# EAGLE design GPS_radiologger_v7 (EAGLE 9.5.2)
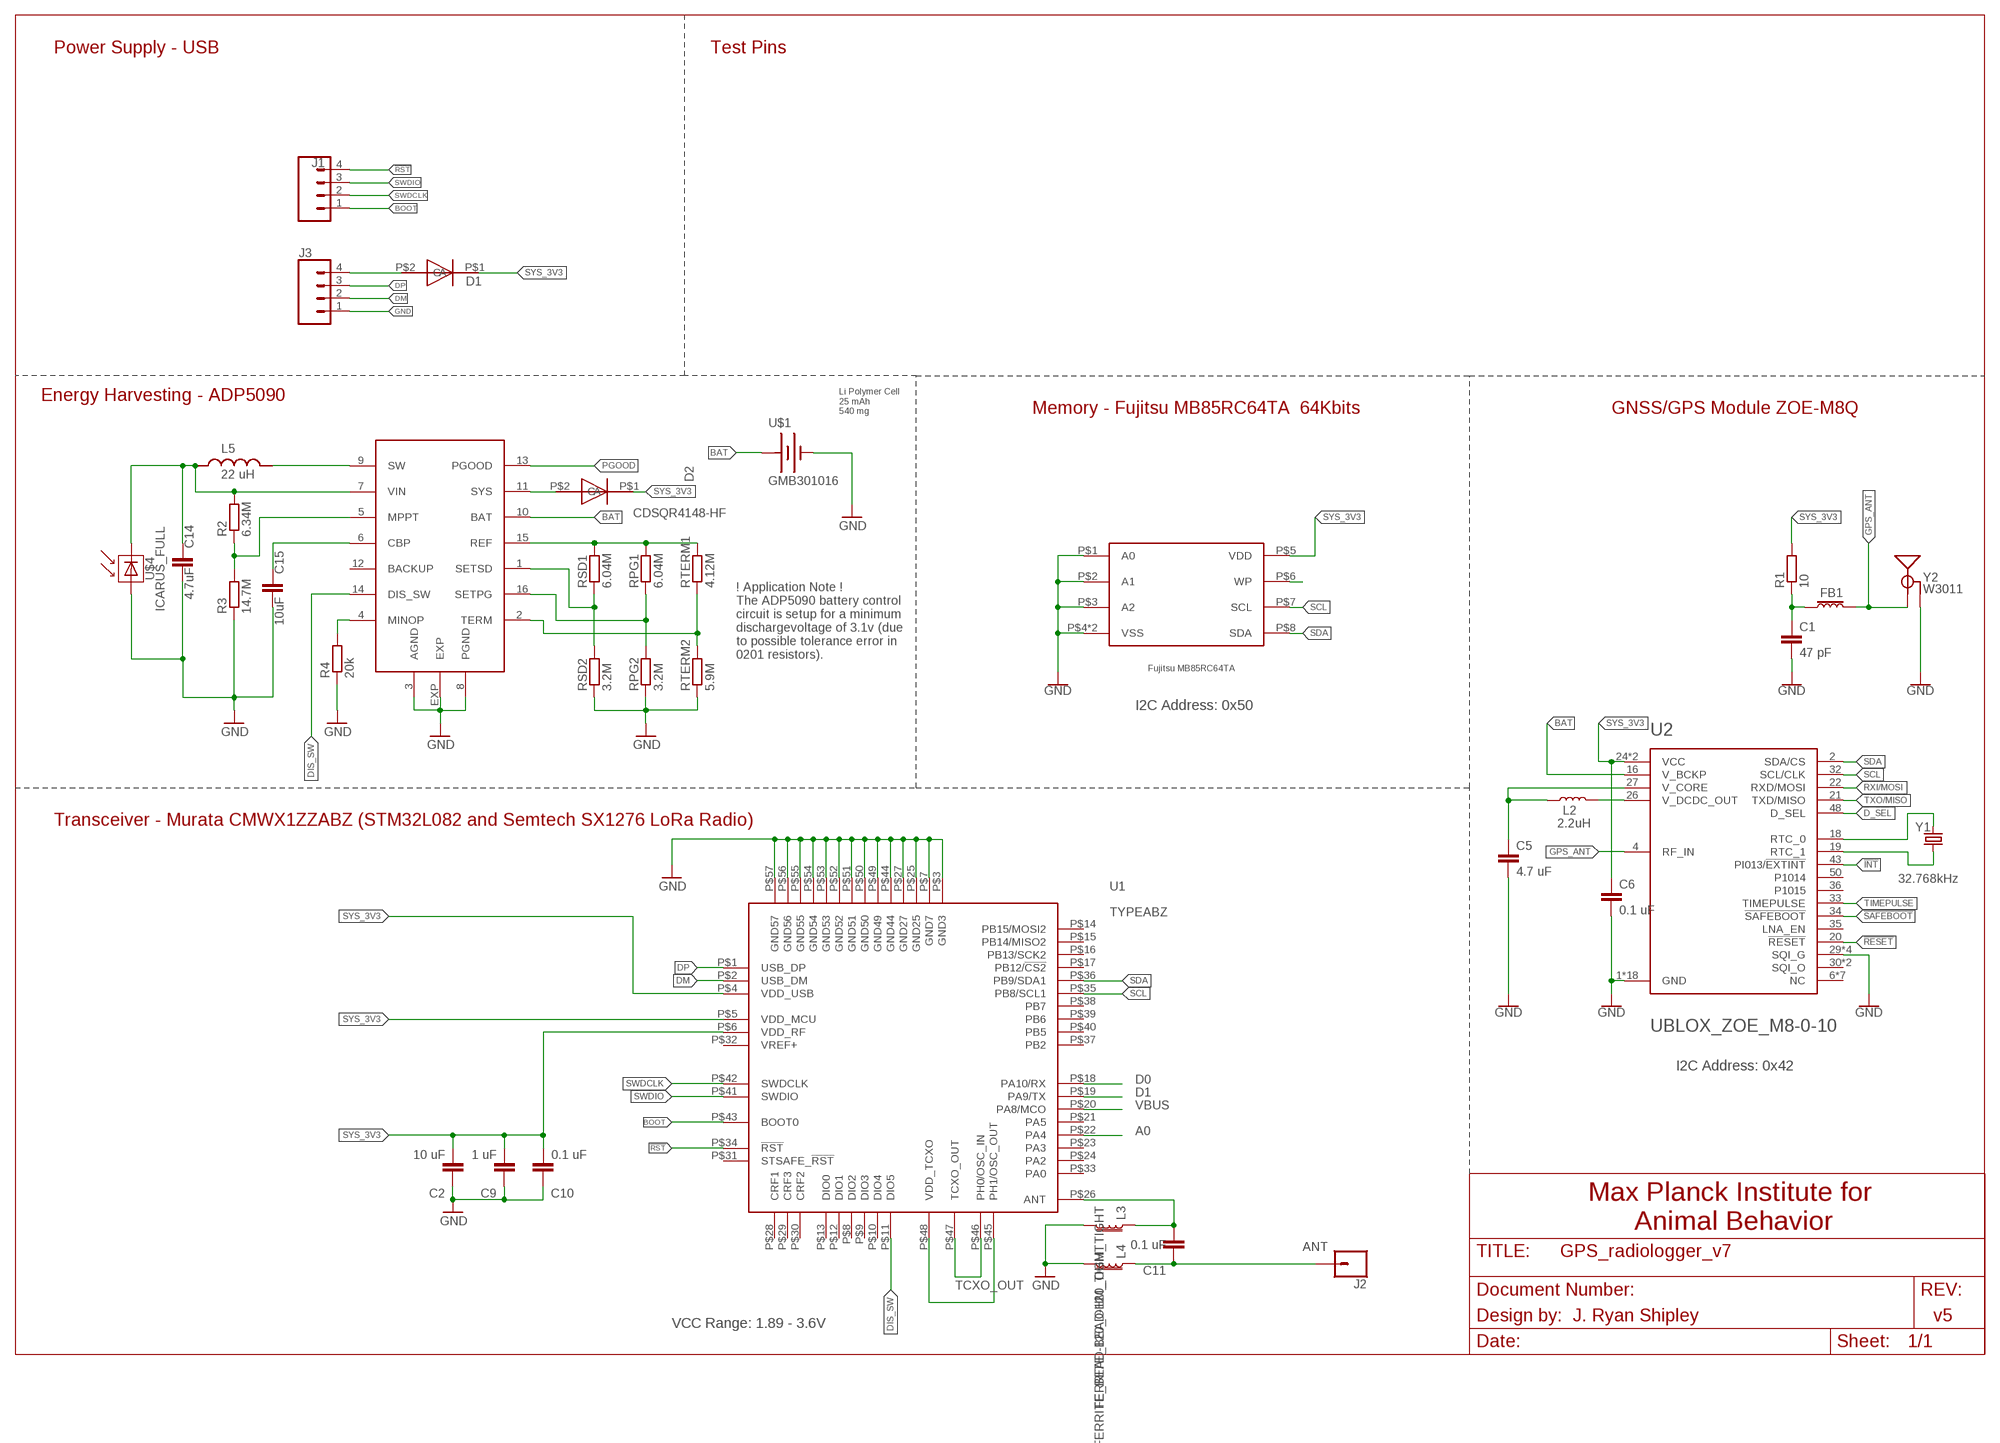
[diagram p0: schematic, sheet 1]

## Parts
C1  47 pF  C-EUC0201  [C0201]
C2  10 uF  C-EUC0201  [C0201]
C5  4.7 uF  C-EUC0201  [C0201]
C6  0.1 uF  C-EUC0201  [C0201]
C9  1 uF  C-EUC0201  [C0201]
C10  0.1 uF  C-EUC0201  [C0201]
C11  0.1 uF  C-EUC0201  [C0201]
C14  4.7uF  C-EUC0201  [C0201]
C15  10uF  C-EUC0402  [C0402]
D1  CDSQR4148-HF  [CDSQR4148-HF]
D2  CDSQR4148-HF  [CDSQR4148-HF]
FB1  FERRITE_BEAD-120_OHM_TIGHT  [0402-TIGHT]
J1  CONN_041.27MM_NO_SILK  [1X04_1.27MM_NO_SILK]
J2  CONN_01PTH_NO_SILK_SMALL  [1X01_SMALL]
J3  CONN_041.27MM_NO_SILK  [1X04_1.27MM_NO_SILK]
L2  2.2uH  2.2μH_SHIELDED_INDUCTOR  [0806]
L3  FERRITE_BEAD-120_OHM_TIGHT  [0402-TIGHT]
L4  FERRITE_BEAD-120_OHM_TIGHT  [0402-TIGHT]
L5  22 uH  LPS4012-103MRB  [IND_LPS4012-103MRB]
R1  10  R-EU_R0201  [R0201]
R2  6.34M  R-EU_R0201  [R0201]
R3  14.7M  R-EU_R0201  [R0201]
R4  20k  R-EU_R0201  [R0201]
RPG1  6.04M  R-EU_R0201  [R0201]
RPG2  3.2M  R-EU_R0201  [R0201]
RSD1  6.04M  R-EU_R0201  [R0201]
RSD2  3.2M  R-EU_R0201  [R0201]
RTERM1  4.12M  R-EU_R0201  [R0201]
RTERM2  5.9M  R-EU_R0201  [R0201]
U1  TYPEABZ  [TYPEABZ]
U2  UBLOX_ZOE_M8-0-10  [UBLOX_ZOE_M8-0-10]
U$1  GMB301016  [GMB301016]
U$2  MB85RC64TA  [8-SON_2X3]
U$3  ADP5090  [LFCSP-16-3X3]
U$4  ICARUS_FULL  [ICARUS_FULL]
Y1  32.768kHz  CRYSTAL-32.768KHZSMD-3.2X1.5  [CRYSTAL-SMD-3.2X1.5MM]
Y2  W3011  GPS_CHIP_ANTENNAW3011  [W3011]

## Nets
!INT: U2.43(PI013/!EXTINT)
!RESET: U2.20(!RESET)
!RST: J1.4 U1.P$34(!RST)
!SAFEBOOT: U2.34(!SAFEBOOT)
A0: U1.P$22(PA4)
ANT: C11.1 J2.P$1 L4.1
BAT: U2.16(V_BCKP) U$1.+ U$3.10(BAT)
BOOT: J1.1 U1.P$43(BOOT0)
D0: U1.P$18(PA10/RX)
D1: U1.P$19(PA9/TX)
D_SEL: U2.48(D_SEL)
DIS_SW: U1.P$11(DIO5) U$3.14(DIS_SW)
DM: J3.2 U1.P$2(USB_DM)
DP: J3.3 U1.P$1(USB_DP)
GND: C1.2 C2.1 C5.2 C6.2 C9.1 C10.1 C14.2 C15.2 J3.1 L3.2 L4.2 R3.1 R4.1 RPG2.1 RSD2.1 RTERM2.1 U1.P$3(GND3) U1.P$7(GND7) U1.P$25(GND25) U1.P$27(GND27) U1.P$44(GND44) U1.P$49(GND49) U1.P$50(GND50) U1.P$51(GND51) U1.P$52(GND52) U1.P$53(GND53) U1.P$54(GND54) U1.P$55(GND55) U1.P$56(GND56) U1.P$57(GND57) U2.1(GND) U2.3(GND) U2.5(GND) U2.7(GND) U2.8(GND) U2.9(GND) U2.10(GND) U2.11(GND) U2.12(GND) U2.17(GND) U2.23(GND) U2.29(SQI_G) U2.31(SQI_G) U2.37(GND) U2.38(GND) U2.39(GND) U2.40(GND) U2.41(GND) U2.44(GND) U2.46(SQI_G) U2.47(SQI_G) U2.49(GND) U$1.- U$2.P$1(A0) U$2.P$2(A1) U$2.P$3(A2) U$2.P$4(VSS) U$2.P$9(VSS) U$4.P$2(MINUS) Y2.2(GND) Y2.3(GND)
GPS_ANT: FB1.1 U2.4(RF_IN) Y2.1(SIGNAL)
N$1: U1.P$45(PH1/OSC_OUT) U1.P$48(VDD_TCXO)
N$2: D2.P$2(A) U$3.11(SYS)
N$3: U$2.P$6(WP)
N$4: L2.2 U2.26(V_DCDC_OUT)
N$5: L5.2 U$3.9(SW)
N$6: U$3.3(AGND) U$3.8(PGND) U$3.EXP ; supply symbol labelled GND
N$7: R2.1 R3.2 U$3.5(MPPT)
N$8: C15.1 U$3.6(CBP)
N$9: C1.1 FB1.2 R1.1
N$10: R4.2 U$3.4(MINOP)
N$11: RTERM1.1 RTERM2.2 U$3.2(TERM)
N$12: RPG1.1 RPG2.2 U$3.16(SETPG)
N$13: C5.1 L2.1 U2.27(V_CORE)
N$14: U2.18(RTC_0) Y1.P$2
N$15: U2.19(RTC_1) Y1.P$1
N$16: RSD1.1 RSD2.2 U$3.1(SETSD)
N$17: RPG1.2 RSD1.2 RTERM1.2 U$3.15(REF)
N$18: D1.P$2(A) J3.4
N$32: C11.2 L3.1 U1.P$26(ANT)
PGOOD: U$3.13(PGOOD)
RXI/MOSI: U2.22(RXD/MOSI)
SCL: U1.P$35(PB8/SCL1) U2.32(SCL/CLK) U$2.P$7(SCL)
SDA: U1.P$36(PB9/SDA1) U2.2(SDA/CS) U$2.P$8(SDA)
SWDCLK: J1.2 U1.P$42(SWDCLK)
SWDIO: J1.3 U1.P$41(SWDIO)
SYS_3V3: C2.2 C6.1 C9.2 C10.2 D1.P$1(C) D2.P$1(C) R1.2 U1.P$4(VDD_USB) U1.P$5(VDD_MCU) U1.P$6(VDD_RF) U2.24(VCC) U2.25(VCC) U$2.P$5(VDD)
TCXO_OUT: U1.P$46(PH0/OSC_IN) U1.P$47(TCXO_OUT)
TIMEPULSE: U2.33(TIMEPULSE)
TXO/MISO: U2.21(TXD/MISO)
VBUS: U1.P$20(PA8/MCO)
VIN: C14.1 L5.1 R2.2 U$3.7(VIN) U$4.P$1(PLUS)
Unconnected: U1.P$8(DIO2) U1.P$9(DIO3) U1.P$10(DIO4) U1.P$12(DIO1) U1.P$13(DIO0) U1.P$14(PB15/MOSI2) U1.P$15(PB14/MISO2) U1.P$16(PB13/SCK2) U1.P$17(PB12/!CS2) U1.P$21(PA5) U1.P$23(PA3) U1.P$24(PA2) U1.P$28(CRF1) U1.P$29(CRF3) U1.P$30(CRF2) U1.P$31(STSAFE_!RST) U1.P$33(PA0) U1.P$37(PB2) U1.P$38(PB7) U1.P$39(PB6) U1.P$40(PB5) U2.6(NC) U2.13(NC) U2.14(NC) U2.15(NC) U2.28(NC) U2.30(SQI_O) U2.35(LNA_EN) U2.36(P1015) U2.42(NC) U2.45(SQI_O) U2.50(P1014) U2.51(NC) U$3.12(BACKUP)

## Notes on the sheet
- Power Supply - USB | Test Pins
- Energy Harvesting - ADP5090
- Li Polymer Cell
  25 mAh
  540 mg
- Memory - Fujitsu MB85RC64TA  64Kbits | GNSS/GPS Module ZOE-M8Q
- ! Application Note !
  The ADP5090 battery control
  circuit is setup for a minimum
  dischargevoltage of 3.1v (due 
  to possible tolerance error in 
  0201 resistors).
- I2C Address: 0x50
- Transceiver - Murata CMWX1ZZABZ (STM32L082 and Semtech SX1276 LoRa Radio)
- I2C Address: 0x42
- Max Planck Institute for 
  Animal Behavior
- Design by: | J. Ryan Shipley | v5
- VCC Range: 1.89 - 3.6V

## Power pins joined to a net without a drawn wire
VREF+: U1.P$32(VREF+)

## Library data of the parts
C1 C2 C5 C6 C9-C11 C14 = rcl:C-EU: CAPACITOR, European symbol; SPICEPREFIX: C
C15 = resistor:C-EU: CAPACITOR, European symbol
D1 D2 = Kris:CDSQR4148-HF: ComChip's CDSQR4148-HF high speed 150 mA Io diode
FB1 L3 L4 = SparkFun-Coils:FERRITE_BEAD-120_OHM_TIGHT
J1 J3 = SparkFun-Connectors:CONN_04: Multi connection point. Often used as Generic Header-pin footprint for 0.1 inch spaced/style header connections On any of the 0.1 inch spaced packages, you can populate with these: Break Away Headers - Straight <https://www.sparkfun.com/products/116> (PRT-00116) Break Away Male Headers - Right Angle <https://www.sparkfun.com/products/553> (PRT-00553) Female Headers <https://www.sparkfun.com/products/115> (PRT-00115) Break Away Headers - Machine Pin <https://www.sparkfun.com/products/117> (PRT-00117) Break Away Female Headers - Swiss Machine Pin <https://www.sparkfun.com/products/743> (PRT-00743) For SCREWTERMINALS and SPRING TERMINALS visit here: Screw Terimnals on SparkFun.com <https://www.sparkfun.com/search/results?term=Screw+Terminals> (5mm/3.5mm/2.54mm spacing) This device is also useful as a general connection point to wire up your design to another part of your project. Our various solder wires solder well into these plated through hole pads. Hook-Up Wire - Assortment (Stranded, 22 AWG) <https://www.sparkfun.com/products/11375> (PRT-11375) Hook-Up Wire - Assortment (Solid Core, 22 AWG) <https://www.sparkfun.com/products/11367> (PRT-11367) View the entire wire category on our website here <https://www.sparkfun.com/categories/141> Special notes: Molex polarized connector foot print use with SKU : PRT-08231 with associated crimp pins and housings. 1MM SMD Version SKU: PRT-10208
J2 = SparkFun-Connectors:CONN_01: Single connection point. Often used as Generic Header-pin footprint for 0.1 inch spaced/style header connections On any of the 0.1 inch spaced packages, you can populate with these: Break Away Headers - Straight <https://www.sparkfun.com/products/116> (PRT-00116) Break Away Male Headers - Right Angle <https://www.sparkfun.com/products/553> (PRT-00553) Female Headers <https://www.sparkfun.com/products/115> (PRT-00115) Break Away Headers - Machine Pin <https://www.sparkfun.com/products/117> (PRT-00117) Break Away Female Headers - Swiss Machine Pin <https://www.sparkfun.com/products/743> (PRT-00743) This device is also useful as a general connection point to wire up your design to another part of your project. Our various solder wires solder well into these plated through hole pads. Hook-Up Wire - Assortment (Stranded, 22 AWG) <https://www.sparkfun.com/products/11375> (PRT-11375) Hook-Up Wire - Assortment (Solid Core, 22 AWG) <https://www.sparkfun.com/products/11367> (PRT-11367) View the entire wire category on our website here <https://www.sparkfun.com/categories/141> Special notes: SMTSO-256-ET is a "flush mount" nut for a 4-40 screw. We mostly use this on specialty testbeds; it is a nice way to connect hardware to your PCB at an adjustable hieght. Also note, the SNAP packages are for using a snappable style connector. We sell a baggie of snaps and they are also used on two LilyPad designs: Snap Assortment - 30 pack (male and female) <https://www.sparkfun.com/products/11347> (DEV-11347) LilyPad Arduino SimpleSnap <https://www.sparkfun.com/products/10941> (DEV-10941) LilyPad SimpleSnap Protoboard <https://www.sparkfun.com/products/10940> (DEV-10940)
L2 = SparkFun-Coils:2.2μH_SHIELDED_INDUCTOR: Murata 2.2uH Inductor 2.2uH 1.2A 110mOhm 0806 Package Shielded; PROD_ID: NDUC-14257
L5 = LPS4012-103MRB:LPS4012-103MRB: Power inductor, shielded, 20/30% tol, SMT, RoHS, lead-free, halogen-free; AVAILABILITY: Unavailable; DESCRIPTION: Power inductor, shielded, 20/30% tol, SMT, RoHS, lead-free, halogen-free; MF: Coilcraft; MP: LPS4012-103MRB; PACKAGE: None; PRICE: None
R1 RSD1 RTERM1 = rcl:R-EU_: RESISTOR, European symbol; SPICEPREFIX: R
R2-R4 RPG1 RPG2 RSD2 RTERM2 = resistor:R-EU_: RESISTOR, European symbol
U1 = Kris:TYPEABZ: CMWX1ZZABZ-078
U2 = SparkFun-GPS:UBLOX_ZOE_M8-0-10: UBLOX ZOE-M8Q-0-10 u-blox ZOE-M8 standard precision GNSS SiP (System in Package) modules feature the high performance u-blox M8 GNSS engine. ZOE-M8’s ultra-miniature form factor integrates a complete GNSS receiver including SAW filter, LNA and TCXO. Handles all GNSS systems and can simulatenously use up to three of them, with accuracy ranging from 2.5m to 4m. GPS GLONASS BeiDou Galileo This can be corrected with the SBAS or QZSS augmentation systems.; PROD_ID: IC-14251
U$1 = Powerstream:GMB301016
U$2 = Fujitsu_FRAM:MB85RC64TA
U$3 = ADP5090_LFCSP-16-3X3:ADP5090
U$4 = TrisolX_Solar_Cells:ICARUS_FULL
Y1 = SparkFun-Clocks:CRYSTAL-32.768KHZ: 32.768kHz Crystal Frequency: 32.768kHz Frequency Stability: ±20ppm Load Capacitance: 12.5pF (PTH-2X6 & SMD-3.2X1.5), 6pF (SMD-2X6) SparkFun Products: SparkFun BigTime Watch Kit <https://www.sparkfun.com/products/11734> SparkFun nRF52832 Breakout <https://www.sparkfun.com/products/13990> SparkFun Real Time Clock Module <https://www.sparkfun.com/products/12708>; PROD_ID: XTAL-13062
Y2 = SparkFun-GPS:GPS_CHIP_ANTENNA; PROD_ID: ANT-14304

## Net classes
1 vcc: width 0 mm

## Board
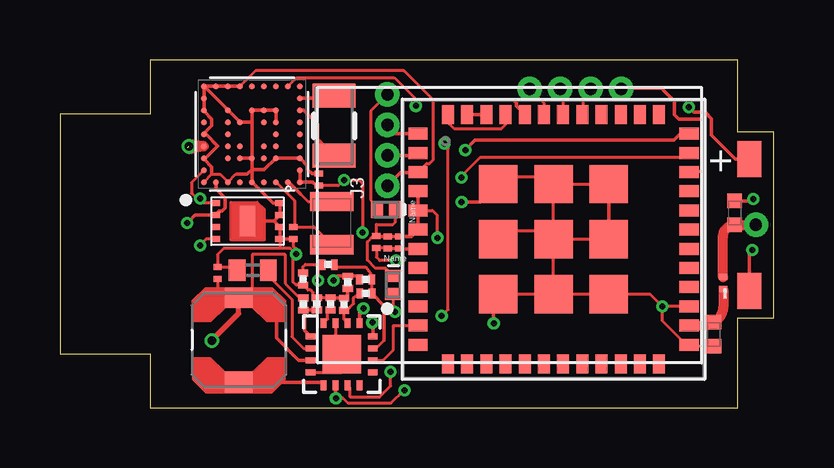
[diagram p1: board, top side]
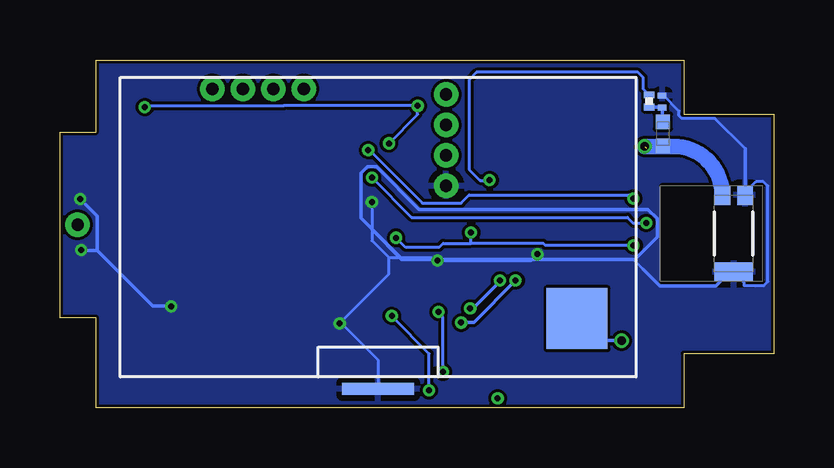
[diagram p2: board, bottom side, seen from below]

Size 29.75 x 14.5 mm. Coordinates in mm from the lower left corner, seen from the top.
Outline: 3.75,0 28.25,0 28.25,3.75 29.75,3.75 29.75,11.5 28.25,11.5 28.25,14.5 3.75,14.5 3.75,12.25 0,12.25 0,2.25 3.75,2.25 3.75,0
Copper layers (1*16): Top 0.035mm / dielectric 0.33mm / Bottom 0.035mm
Design rules "default *": minimum track width 5mil, minimum drill 0.25mm, track to track 5mil, track to pad 5mil, pad to pad 5mil, via to via 5mil, smd to smd 5mil, copper to edge 5mil, drill to drill 3mil, minimum pad ring 10mil, minimum via ring 5mil, stop-mask expansion 4mil, vias tented up to drill 0mil, thermal gap 10mil

### Footprints (pad centres in the part's own frame; a part is rotated, then mirrored left to right if it is on the bottom)
C0201 = smd 0.25 x 0.35: 1 -0.25,0; 2 0.25,0
C0402 = smd 0.7 x 0.9: 1 -0.65,0; 2 0.65,0
CDSQR4148-HF = smd 0.7 x 0.5: P$1 0,0.375; P$2 0,-0.375
0402-TIGHT = smd 0.6 x 0.6: 1 -0.5,0; 2 0.5,0
1X04_1.27MM_NO_SILK = drill 0.508 pad 1: 1 0,0; 2 1.27,0; 3 2.54,0; 4 3.81,0
1X01_SMALL = drill 0.508: P$1 0,0
0806 = smd 0.8 x 1.8: 1 -0.9,0; 2 0.9,0
IND_LPS4012-103MRB = smd 0.87 x 1.15: 1 -1.765,0; 2 1.765,0
R0201 = smd 0.28 x 0.43: 1 -0.255,0; 2 0.255,0
TYPEABZ = smd 0.8 x 0.5: P$1 -5.65,4.4; P$2 -5.65,3.6; P$3 -5.65,2.8; P$4 -5.65,2; P$5 -5.65,1.2; P$6 -5.65,0.4; P$7 -5.65,-0.4; P$8 -5.65,-1.2; P$9 -5.65,-2; P$10 -5.65,-2.8; P$11 -5.65,-3.6; P$12 -5.65,-4.4; P$25 5.65,-4.4; P$26 5.65,-3.6; P$27 5.65,-2.8; P$28 5.65,-2; P$29 5.65,-1.2; P$30 5.65,-0.4; P$31 5.65,0.4; P$32 5.65,1.2; P$33 5.65,2; P$34 5.65,2.8; P$35 5.65,3.6; P$36 5.65,4.4 | smd 0.5 x 0.8: P$13 -4.4,-5.2; P$14 -3.6,-5.2; P$15 -2.8,-5.2; P$16 -2,-5.2; P$17 -1.2,-5.2; P$18 -0.4,-5.2; P$19 0.4,-5.2; P$20 1.2,-5.2; P$21 2,-5.2; P$22 2.8,-5.2; P$23 3.6,-5.2; P$24 4.4,-5.2; P$37 4.4,5.2; P$38 3.6,5.2; P$39 2.8,5.2; P$40 2,5.2; P$41 1.2,5.2; P$42 0.4,5.2; P$43 -0.4,5.2; P$44 -1.2,5.2; P$45 -2,5.2; P$46 -2.8,5.2; P$47 -3.6,5.2; P$48 -4.4,5.2 | smd 1.6 x 1.6: P$49 -2.3,2.3; P$50 0,2.3; P$51 2.3,2.3; P$52 -2.3,0; P$53 0,0; P$54 2.3,0; P$55 -2.3,-2.3; P$56 0,-2.3; P$57 2.3,-2.3
UBLOX_ZOE_M8-0-10 = smd 0.25 x 0.25: 1 -1.996,2.004; 2 -1.496,2.004; 3 -0.996,2.004; 4 -0.496,2.004; 5 0.004,2.004; 6 0.504,2.004; 7 1.004,2.004; 8 1.504,2.004; 9 2.004,2.004; 10 2.004,1.504; 11 2.004,1.004; 12 2.004,0.504; 13 2.004,0.004; 14 2.004,-0.496; 15 2.004,-0.996; 16 2.004,-1.496; 17 2.004,-1.996; 18 1.504,-1.996; 19 1.004,-1.996; 20 0.504,-1.996; 21 0.004,-1.996; 22 -0.496,-1.996; 23 -0.996,-1.996; 24 -1.496,-1.996; 25 -1.996,-1.996; 26 -1.996,-1.496; 27 -1.996,-0.996; 28 -1.996,-0.496; 29 -1.996,0.004; 30 -1.996,0.504; 31 -1.996,1.004; 32 -1.996,1.504; 33 -0.996,1.004; 34 -0.496,1.004; 35 0.004,1.004; 36 0.504,1.004; 37 1.004,1.004; 38 1.004,0.004; 39 1.004,-0.496; 40 1.004,-0.996; 41 0.504,-0.996; 42 0.004,-0.996; 43 -0.496,-0.996; 44 -0.996,-0.996; 45 -0.996,-0.496; 46 -0.996,0.004; 47 -0.996,0.504; 48 -0.496,0.504; 49 0.504,0.504; 50 0.504,-0.496; 51 -0.496,-0.496
GMB301016 = smd 1.5 x 1: + -2.75,10; - 2.75,10
8-SON_2X3 = smd 0.25 x 0.4: P$1 0.75,-1.35; P$2 0.25,-1.35; P$3 -0.25,-1.35; P$4 -0.75,-1.35; P$5 -0.75,1.35; P$6 -0.25,1.35; P$7 0.25,1.35; P$8 0.75,1.35 | smd 1.27 x 0.635: P$9 0,0
LFCSP-16-3X3 = smd 0.4 x 0.25: 1 -1.3,0.75; 2 -1.3,0.25; 3 -1.3,-0.25; 4 -1.3,-0.75; 9 1.3,-0.75; 10 1.3,-0.25; 11 1.3,0.25; 12 1.3,0.75 | smd 0.25 x 0.4: 5 -0.75,-1.3; 6 -0.25,-1.3; 7 0.25,-1.3; 8 0.75,-1.3; 13 0.75,1.3; 14 0.25,1.3; 15 -0.25,1.3; 16 -0.75,1.3 | smd 1.6 x 1.6: EXP 0,0
ICARUS_FULL = smd 2.54 x 2.54: P$1 -3.81,-8.29 | smd 0.5 x 3: P$2 -6.75,0
CRYSTAL-SMD-3.2X1.5MM = smd 1 x 1.8: P$1 -1.25,0; P$2 1.25,0
W3011 = smd 0.8 x 0.65: 1 1.6,0.475; 2 1.6,-0.475 | smd 0.8 x 1.6: 3 -1.6,0

### Placement (x,y rotation side)
C1  4.64,12.75 90 bottom
C2  14.15,6.89 90 top
C5  9.72,7.28 270 top
C6  10.8,9.5 90 top
C9  13.67,6.89 90 top
C10  13.2,6.9 90 top
C11  27.64,5.19 270 top
C14  6.57,5.62 90 top
C15  8.04,5.73 180 top
D1  13.58,8.26 270 top
D2  13.9,5.12 0 top
FB1  4.61,11.42 90 bottom
J1  19.58,13.29 0 top
J2  29.01,7.62 0 top
J3  13.65,9.25 90 top
L2  11.33,7.69 90 top
L3  27.26,3.06 270 top
L4  28.13,8.12 90 top
L5  7.46,2.82 270 top
R1  5.18,12.78 90 bottom
R2  10.15,4.31 90 top
R3  10.71,4.32 270 top
R4  11.28,4.32 270 top
RPG1  11.18,5.96 0 top
RPG2  10.13,5.36 90 top
RSD1  12.75,5.34 0 top
RSD2  12,5.23 90 top
RTERM1  12.75,4.76 0 top
RTERM2  11.84,4.31 270 top
U1  20.58,7.02 0 top
U2  8,11.4 90 top
U$1  18.75,7.61 270 top
U$2  7.82,7.78 90 top
U$3  11.75,2.23 270 top
U$4  16.48,7.52 90 bottom
Y1  11.43,11.76 90 top
Y2  1.66,7.26 90 bottom

### Tracks (layer width: path | path; a pad name or v marks a point on that pad's centre or on a via)
!RST
  Top 0.127: 25.12,13.27 25.09,13.29 J1.4
  Top 0.152: U1.P$34 26.25,9.84 26.76,9.84 26.89,9.97 26.89,11.93 26.79,12.04 25.8,12.04 25.61,12.22 25.61,12.78 25.12,13.27
ANT
  Top 0.152: L4.1
  Top 0.406: C11.1 27.64,7.13 arc-90 L4.1 | L4.1 J2.P$1
BAT  (via drill 0.25)
  Top 0.127: v11.5,0.38 11.52,0.4 11.79,0.4 11.99,0.19 13.8,0.19 14.34,0.72 v14.36,0.72 | v15.92,3.82 v15.92,3.83 16.18,4.09 16.18,10.79 16.04,10.93 v16.04,11.02 | U2.16 9.85,13.76 13.94,13.76 14.83,12.87 v14.83,12.58
  Top 0.152: U$1.+ 28.16,10.36 27.17,11.36 27.17,12.05 26.9,12.31 26.43,12.31 v26.21,12.53 | v11.5,0.38 U$3.10
  Bottom 0.127: v26.21,12.53 26.17,12.57 20.43,12.57 20.42,12.58 v14.83,12.58 14.83,12.22 v16.04,11.02 | v14.36,0.72 14.36,2.25 15.92,3.8 v15.92,3.82
BOOT
  Top 0.127: J1.1 20.18,12.7 U1.P$43
DIS_SW
  Top 0.127: U$3.14 13.47,1.98 13.9,2.41 13.9,3.42 U1.P$11
DM
  Top 0.152: U1.P$2 14.82,10.52 J3.2
DP
  Top 0.152: U1.P$1 14.02,11.42 J3.3
GND  (via drill 0.25)
  Top 0.127: R3.1 10.55,4.74 10.55,4.79 10.44,4.9 10.34,4.9 RPG2.1 9.85,5.11 9.71,5.24 9.71,6.5 9.73,6.51 9.6,6.64 9.17,6.64 | C15.2 7.25,5.87 C14.2 6.57,6.38 6.83,6.64 9.17,6.64 | C5.2 9.72,6.75 9.86,6.61 | U1.P$56 U1.P$57 24.61,4.72 v25.11,4.22 | U1.P$56 U1.P$55 18.07,4.72 | U1.P$56 U1.P$53 | U1.P$53 U1.P$50 | U1.P$50 U1.P$51 | U1.P$50 20.29,9.61 18.1,9.61 18.1,9.49 U1.P$49 | U1.P$53 20.23,7.37 18.19,7.37 18.19,7.11 U1.P$52 | U1.P$53 U1.P$54 | U1.P$3 15.29,10.18 15.41,10.18 15.56,10.34 15.56,12.82 14.34,14.05 8.15,14.05 U2.12 | U1.P$27 v25.11,4.22 | U$2.P$4 9.17,6.64 | L3.2 26.29,2.56 U1.P$25 26.11,2.62 25.11,3.62 v25.11,4.22 | U2.1 6.33,9.73 6.33,9.77 6.37,9.73 6.67,9.73 U2.31 7.33,9.73 7.37,9.73 | C9.1 C10.1 13.2,6.28 13.34,6.13 v14.01,6.13 | R4.1 R3.1 | R3.1
  Top 0.152: 8,11.95 U2.38 U2.39 U2.40 U2.41 | 8,11.95 U2.46 | U2.46 U2.47 | 8,11.95 7.95,11.9 U2.49 U2.37 U2.9 | U2.46 8,9.92 | 8,9.92 U2.29 8.88,8.53 U$2.P$1 U$2.P$2 8.92,7.78 | 8,9.92 8.52,9.92 U2.44 U2.23 10.33,10.07 10.33,9.92 10.5,9.75 C6.2 | 8,9.92 7.81,9.73 7.37,9.73 | U2.9 U2.10 U2.12 | U2.9 U2.8 U2.7 6,12.37 6.33,12.04 6.33,11.77 6,11.44 U2.5 6.08,11.4 6.58,10.91 6.08,10.4 U2.3 6,10.37 6.33,10.04 6.33,9.77 | 8.92,7.78 U$2.P$9 | 8.92,7.78 U$2.P$3 U$2.P$4 C5.2 | R4.1 11.83,4.58 RTERM2.1 12,4.72 RSD2.1 | 18.07,4.72 18.07,3.53 v18.09,3.51 | U1.P$52 18.16,7.14 | U1.P$51 U1.P$54 | U1.P$3 14.9,9.79 14.2,9.79 J3.1 | C9.1 C2.1 14.17,6.62 U1.P$7 | U1.P$44 19.03,12.57 19.03,12.71 18.91,12.82 15.56,12.82 | 17.53,8.58 v16.75,8.58 | v9.84,6.4 9.71,6.53 | 9.86,6.61 9.83,6.64 9.71,6.53 | 9.71,6.5 9.71,6.53 | U$1.- 28.75,6.57 v28.86,6.57 | v28.91,8.7 28.91,8.62 L4.2 | R3.1
  Bottom 0.127: U$4.P$2 16.48,1.98 18.02,3.51 | v18.09,3.51 16.04,5.56 16.04,6.25 | v16.75,8.58 16.75,7.42 16.75,6.97 16.04,6.25 | 16.04,6.25 13.89,6.25 | v14.01,6.13 10.11,6.13 v9.84,6.4 9.79,6.4 9.58,6.19 5.84,6.19 5.42,5.76 | 1.19,10.8 2.44,12.06 3.83,12.06 3.94,12.17 3.94,12.37 4.57,13 C1.2 | Y2.3 1.23,5.23 1.23,5.09 0.4,5.09 0.24,5.26 0.24,9.24 0.42,9.42 0.74,9.42 1.19,8.97 Y2.2
  Bottom 0.152: v18.09,3.51 18.02,3.51 | Y2.3 1.82,5.66 2.4,5.08 4.74,5.08 5.42,5.76 | Y2.2 1.19,10.8 | v14.01,6.13 13.89,6.25 | v28.86,6.57 28.84,6.55 28.2,6.55 | 16.75,7.42 15.5,6.17 15.47,6.17 | 15.47,6.17 5.79,6.17 4.85,7.1 4.85,7.88 5.23,8.26 14.77,8.26 16.56,10.05 16.94,10.05 17.2,9.78 17.2,7.9 15.47,6.17 | 28.2,6.55 25.89,4.23 25.12,4.23 v25.11,4.22 | v28.91,8.7 28.2,7.99 28.2,6.55
  pour Bottom (isolate 0.1): 0.12,12.19 3.85,12.19 3.85,14.48 28.14,14.48 28.14,11.45 28.14,11.39 29.68,11.39 29.68,3.84 28.2,3.84 28.2,0.08 3.84,0.08 3.84,2.33 0.09,2.33 0.09,12.19 0.11,12.19
GPS_ANT  (via drill 0.35)  (1 unrouted)
  Top 0.127: U2.4 | 5.37,10.9 v5.36,10.9 v5.37,10.89
  Top 0.406: U2.4 5.37,10.9
  Bottom 0.127: 4.61,10.82 5.3,10.82
  Bottom 0.152: FB1.1 4.61,10.82
  Bottom 0.65: Y2.1 arc-90 4.17,10.89 v5.37,10.89
N$1
  Top 0.127: U1.P$48 16.26,12.14 16.26,11.8 16.45,11.62 18.39,11.62 18.58,11.81 U1.P$45
N$2  (via drill 0.25)
  Top 0.127: U$3.11 12.08,0.84 12.08,0.46 12.1,0.45 13.33,0.45 13.78,0.9 v13.78,1.49 | v13.97,3.98 13.9,4.05 D2.P$2
  Bottom 0.127: v13.78,1.49 13.78,3.78 13.97,3.97 v13.97,3.98
N$4
  Top 0.127: 10.03,8.91 10.35,8.59 L2.2
  Top 0.152: U2.26 9.54,9.4 10.03,8.91
N$5
  Top 0.152: U$3.9 11,1.05 L5.2
N$6
  Top 0.127: U$3.3 11.5,2.23 | U$3.8 11.75,1.48
  Top 0.152: 11.5,2.23 U$3.EXP 11.75,1.48
N$7
  Top 0.152: U$3.5 10.2,3.23 10.2,4.06 R2.1 R3.2
N$8
  Top 0.127: 8.89,5.44 8.89,5.29 9.67,4.51 9.67,2.95 10.15,2.48 U$3.6
  Top 0.152: 8.89,5.44 C15.1
N$9
  Bottom 0.152: FB1.2 4.64,11.95 C1.1 4.67,12.53 R1.1
N$10
  Top 0.127: U$3.4 11.16,3.69 11.16,4.04
  Top 0.152: R4.2 11.21,3.99 11.16,4.04
N$11
  Top 0.127: U$3.2 11.84,3.68 RTERM2.2 11.86,4.03 11.94,4.03 12.25,4.34 12.25,4.57 RTERM1.1
N$12  (via drill 0.25)
  Top 0.127: RPG2.2 10.13,5.87 10.23,5.97 10.24,5.96 RPG1.1
  Top 0.152: RPG1.1 10.75,5.88 10.75,5.35 10.78,5.33 v10.75,5.3 | v13.02,3.54 13.05,3.52 U$3.16
  Bottom 0.152: v10.75,5.3 12.5,3.56 13.05,3.56 13.03,3.54 v13.02,3.54
N$13
  Top 0.127: U2.27 9.77,8.63 9.77,7.58 C5.1 10.59,7.53 L2.1
N$14
  Top 0.152: Y1.P$2 11.33,12.9 U2.18
N$15
  Top 0.152: Y1.P$1 10.75,11.19 10.75,11.82 10.16,12.4 U2.19
N$16  (via drill 0.25)
  Top 0.152: U$3.1 12.5,3.99 12.64,4.13 v12.65,4.13 | RSD1.1 12.36,5.48 RSD2.2 11.58,5.48 v11.4,5.3
  Bottom 0.152: v12.65,4.13 12.64,4.12 12.56,4.12 11.39,5.29 v11.4,5.3
N$17
  Top 0.127: 13.52,2.81 13.18,2.48 U$3.15 | RPG1.2 11.57,5.83 12.77,5.83 13,5.52 RSD1.2 RTERM1.2
  Top 0.152: 13.52,2.81 13.52,4.25 RTERM1.2
N$18
  Top 0.127: D1.P$2 13.21,8.41 12.95,8.66 12.95,12.36 J3.4
N$19
  Top 0.152: 6.05,10.78 5.38,10.64
N$20
  Top 0.152: 6.04,11.03 5.43,11.14
N$32
  Top 0.127: C11.2 27.66,4.88 | L3.1 27.13,3.42 U1.P$26
  Top 0.406: U1.P$26 26.83,3.42 arc90 27.66,4.25 27.66,4.88
SCL  (via drill 0.25)
  Top 0.127: U1.P$35 26.04,10.43 17.52,10.43 16.75,9.66 v16.75,9.59
  Top 0.152: U2.32 6.5,9.11 6.88,8.74 6.88,8.32 6.76,8.2 6.64,8.2 U$2.P$7 5.64,8.03 v5.31,7.69
  Bottom 0.127: v16.75,9.59 15.09,7.93 6.09,7.93 5.86,7.69 v5.31,7.69
SDA  (via drill 0.25)
  Top 0.127: U$2.P$8 5.9,8.53 5.78,8.65 | 5.78,8.65 v5.85,8.71 | 5.78,8.65 5.48,8.95 5.48,9.38 U2.2
  Top 0.152: U1.P$36 25.86,11.42 25.6,11.16 17.31,11.16 v16.9,10.74
  Bottom 0.127: v16.9,10.74 16.85,10.74 14.64,8.53 13.03,8.53 12.69,8.87 6,8.87 v5.85,8.71
SWDCLK
  Top 0.127: J1.2 20.98,13.17 U1.P$42
SWDIO
  Top 0.127: J1.3 21.8,12.97 21.8,12.24
  Top 0.152: 21.8,12.24 U1.P$41
SYS_3V3  (via drill 0.25)
  Top 0.127: U$2.P$5 6.1,7.03 v5.84,6.76 | U1.P$5 15.53,8.22 15.74,8.01 v15.74,7.08 | D1.P$1 13.96,7.71 13.89,7.64 13.2,7.64 C10.2 13.06,7.15 12.82,6.91 12.82,6.15 13.16,5.81 13.59,5.81 D2.P$1 | C6.1 11.59,9.25 v11.84,9.49 12.46,9.49 12.61,9.35 v12.61,7.31
  Top 0.152: U1.P$4 U1.P$5 U1.P$6 14.65,7.14 C2.2 C9.2 C10.2 | U2.24 U2.25 10.54,9.4 10.69,9.25 C6.1
  Bottom 0.127: v15.74,7.08 15.34,6.68 13.94,6.68 13.78,6.85 12.61,6.85 | R1.2 5.43,13.28 5.43,13.77 5.65,13.98 12.38,13.98 12.7,13.67 12.7,9.94 12.24,9.47 11.85,9.47 v11.84,9.49 | v5.84,6.76 9.52,6.76 9.6,6.85 12.61,6.85 | 12.62,6.86 12.61,6.85 | 12.61,6.85 v12.61,7.31
TCXO_OUT
  Top 0.152: U1.P$47 U1.P$46
VIN  (via drill 0.35)
  Top 0.127: L5.1 6.57,4.58 C14.1 | 8.08,4.58 8.02,4.65 8.02,6.38 9.39,6.38 9.39,5.18 10,4.57 R2.2
  Top 0.152: L5.1 8.08,4.58 8.72,4.58 9.04,4.28 9.03,4.27 9.03,2.91 9.96,1.98 U$3.7
  Top 0.2: v6.33,2.79 7.46,3.92 L5.1
  Bottom 0.152: U$4.P$1 7.28,2.79 v6.33,2.79